# EasyEDA schematic Reefwing-NFC-Card-RevC.json
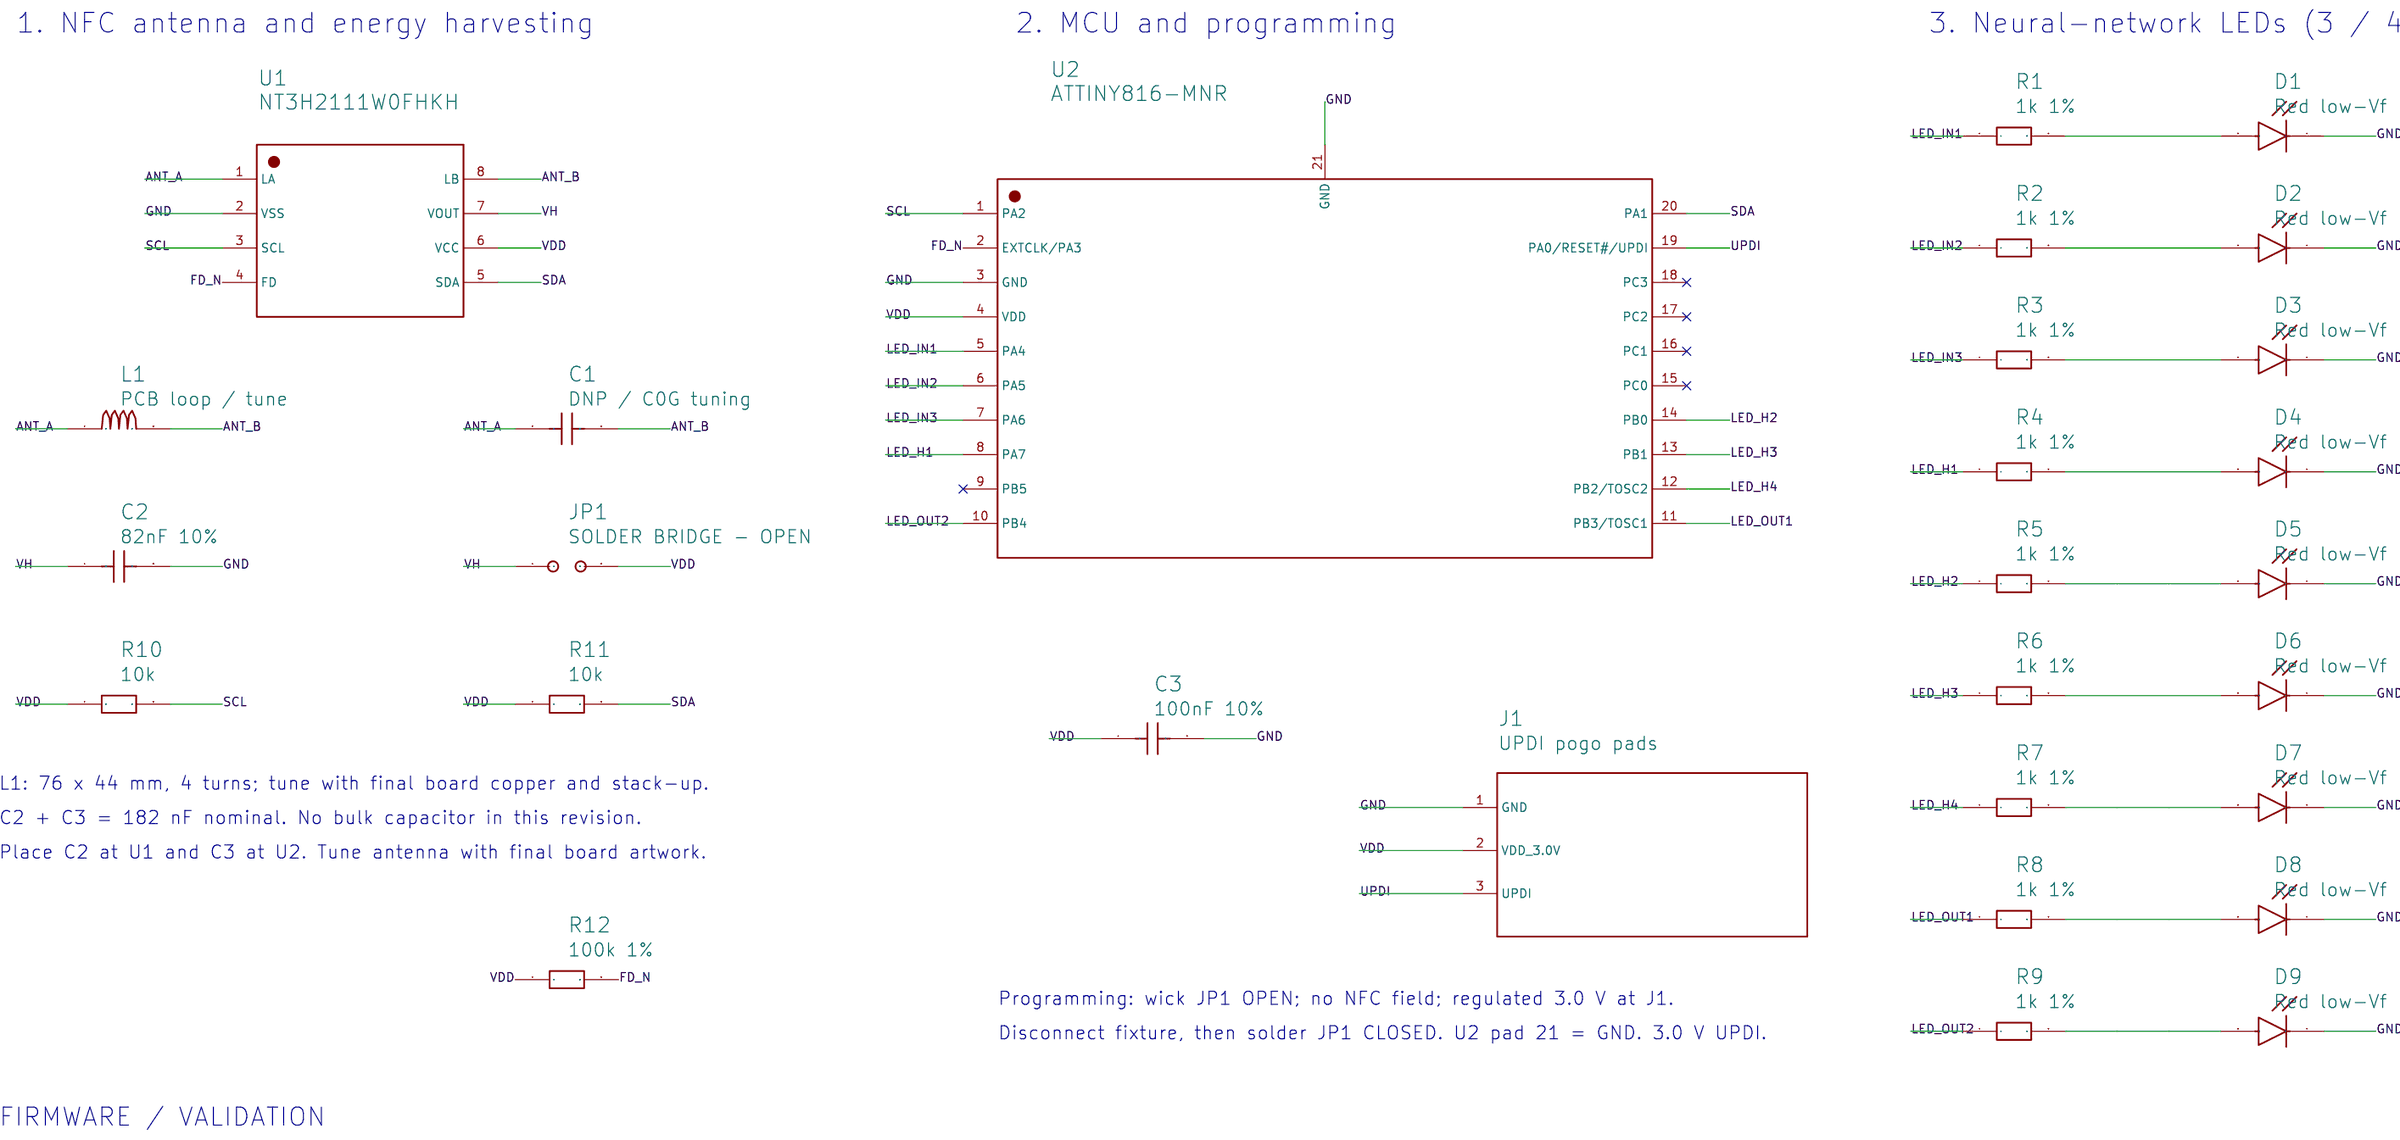
[diagram p0: schematic sheet]

## Parts
C1  DNP / C0G tuning  [C0603]
C2  82nF 10%  [C0603]
C3  100nF 10%  [C0603]
D1  Red low-Vf  [LED-SMD_L1.6-W0.8-R-RD]
D2  Red low-Vf  [LED-SMD_L1.6-W0.8-R-RD]
D3  Red low-Vf  [LED-SMD_L1.6-W0.8-R-RD]
D4  Red low-Vf  [LED-SMD_L1.6-W0.8-R-RD]
D5  Red low-Vf  [LED-SMD_L1.6-W0.8-R-RD]
D6  Red low-Vf  [LED-SMD_L1.6-W0.8-R-RD]
D7  Red low-Vf  [LED-SMD_L1.6-W0.8-R-RD]
D8  Red low-Vf  [LED-SMD_L1.6-W0.8-R-RD]
D9  Red low-Vf  [LED-SMD_L1.6-W0.8-R-RD]
J1  UPDI pogo pads  [REEFWING_UPDI_3PAD_P254_D150]
JP1  SOLDER BRIDGE - OPEN  [REEFWING_SOLDER_BRIDGE_2P_G030]
L1  PCB loop / tune  [REEFWING_NFC_76X44_4T_W040_S040]
R1  1k 1%  [R0603]
R2  1k 1%  [R0603]
R3  1k 1%  [R0603]
R4  1k 1%  [R0603]
R5  1k 1%  [R0603]
R6  1k 1%  [R0603]
R7  1k 1%  [R0603]
R8  1k 1%  [R0603]
R9  1k 1%  [R0603]
R10  10k  [R0603]
R11  10k  [R0603]
R12  100k 1%  [R0603]
U1  NT3H2111W0FHKH  [XQFN-8_L1.6-W1.6-P0.50-BL_NT3H2111W0FHKH]
U2  ATTINY816-MNR  [UQFN-20_L3.0-W3.0-P0.40-BL-EP1.7]

## Library data of the parts
C2 = -: Supplier: LCSC; Manufacturer: YAGEO(国巨); Manufacturer Part: CC0603KRX7R9BB823; Supplier Part: C107100; JLCPCB Part Class: Extended Part
C3 = -: Supplier: LCSC; Manufacturer: YAGEO(国巨); Manufacturer Part: CC0603KRX7R9BB104; Supplier Part: C14663; JLCPCB Part Class: Basic Part
D1-D9 = -: Supplier: LCSC; Manufacturer: KENTO; Manufacturer Part: KT-0603R; Supplier Part: C2286; JLCPCB Part Class: Basic Part
R1-R9 = -: Supplier: LCSC; Manufacturer: UNI-ROYAL(厚声); Manufacturer Part: 0603WAF1001T5E; Supplier Part: C21190; JLCPCB Part Class: Basic Part
R10 R11 = -: Supplier: LCSC; Manufacturer: UNI-ROYAL(厚声); Manufacturer Part: 0603WAF1002T5E; Supplier Part: C25804; JLCPCB Part Class: Basic Part
R12 = -: Supplier: LCSC; Manufacturer: UNI-ROYAL(厚声); Manufacturer Part: 0603WAF1003T5E; Supplier Part: C25803; JLCPCB Part Class: Basic Part
U1 = -: Contributor: LCSC; Supplier: LCSC; Supplier Part: C710403; Manufacturer: NXP(恩智浦); JLCPCB Part Class: Extended Part
U2 = -: Contributor: LCSC; Supplier: LCSC; Supplier Part: C2052778; Manufacturer: MICROCHIP(美国微芯); JLCPCB Part Class: Extended Part

## Nets
GND: C2.2 C3.2 D1.1(K) D2.1(K) D3.1(K) D4.1(K) D5.1(K) D6.1(K) D7.1(K) D8.1(K) D9.1(K) J1.1(GND) U1.2(VSS) U2.3(GND) U2.21(GND)
VDD: C3.1 J1.2(VDD 3.0V) JP1.2 R10.1 R11.1 R12.1 U1.6(VCC) U2.4(VDD)
ANT_A: C1.1 L1.1 U1.1(LA)
ANT_B: C1.2 L1.2 U1.8(LB)
FD_N: R12.2 U1.4(FD) U2.2(EXTCLK/PA3)
LED_H1: R4.1 U2.8(PA7)
LED_H2: R5.1 U2.14(PB0)
LED_H3: R6.1 U2.13(PB1)
LED_H4: R7.1 U2.12(PB2/TOSC2)
LED_IN1: R1.1 U2.5(PA4)
LED_IN2: R2.1 U2.6(PA5)
LED_IN3: R3.1 U2.7(PA6)
LED_OUT1: R8.1 U2.11(PB3/TOSC1)
LED_OUT2: R9.1 U2.10(PB4)
SCL: R10.2 U1.3(SCL) U2.1(PA2)
SDA: R11.2 U1.5(SDA) U2.20(PA1)
UPDI: J1.3(UPDI) U2.19(PA0/RESET#/UPDI)
VH: C2.1 JP1.1 U1.7(VOUT)
Net-(D1-2): D1.2(A) R1.2
Net-(D2-2): D2.2(A) R2.2
Net-(D3-2): D3.2(A) R3.2
Net-(D4-2): D4.2(A) R4.2
Net-(D5-2): D5.2(A) R5.2
Net-(D6-2): D6.2(A) R6.2
Net-(D7-2): D7.2(A) R7.2
Net-(D8-2): D8.2(A) R8.2
Net-(D9-2): D9.2(A) R9.2

Not connected (* = marked no-connect by the designer): U2 9(PB5)* 15(PC0)* 16(PC1)* 17(PC2)* 18(PC3)*

## Notes on the sheet
- REEFWING / EMBEDDED AI - NFC BUSINESS CARD
- Rev C - review corrections | 2026-09-12
- JLC order codes assigned. IC symbols and footprints linked to LCSC libraries. Prototype validation required.
- 1. NFC antenna and energy harvesting
- 2. MCU and programming
- 3. Neural-network LEDs (3 / 4 / 2)
- L1: 76 x 44 mm, 4 turns; tune with final board copper and stack-up.
- C2 + C3 = 182 nF nominal. No bulk capacitor in this revision.
- Place C2 at U1 and C3 at U2. Tune antenna with final board artwork.
- Programming: wick JP1 OPEN; no NFC field; regulated 3.0 V at J1.
- Disconnect fixture, then solder JP1 CLOSED. U2 pad 21 = GND. 3.0 V UPDI.
- FIRMWARE / VALIDATION
- Start LEDs off; use 1.25 MHz (20 MHz / 16) early for lower current. One LED at a time.
- Use a repeating 3-input / 4-hidden / 2-output sequence. Restart cleanly after NFC power loss.
- Prototype fuse plan: BOD disabled; verify readback. No safe operation claimed below 1.8 V.
- NFC URL is programmed over RF. I2C is available for configuration; avoid bus activity during animation.
- PROTOTYPE: antenna tuning, LED brightness, rail droop and assembly review remain before release.
- I2C: PA1=SDA, PA2=SCL (alternate TWI0). Set PORTMUX.CTRLB |= PORTMUX_TWI0_bm before TWI init.
- FD_N: U1.4 -> U2.2 (PA3), R12=100k to VDD. Active low; configure FD_ON=00, FD_OFF=00.
- Unused MCU pins: PB5, PC0-PC3. Inputs with pull-ups or disabled digital buffers. Preserve UPDI/PA0.
- R1-R9=1k: about 0.30 mA at 2.0 V, Vf=1.7 V, before GPIO loss. Measure before choosing 470R.
- VOUT -> JP1 -> VDD / VCC follows NXP section 8.6, Fig.16. Fixture can power I2C with RF absent.
- Lowest BOD is 1.8 V nominal (1.7-2.0 V range); there is no guaranteed sub-1.8 V threshold.
- L1 unchanged; 50 pF suggests 2.75 uH at 13.56 MHz. Measure L/resonance, then select C1.
